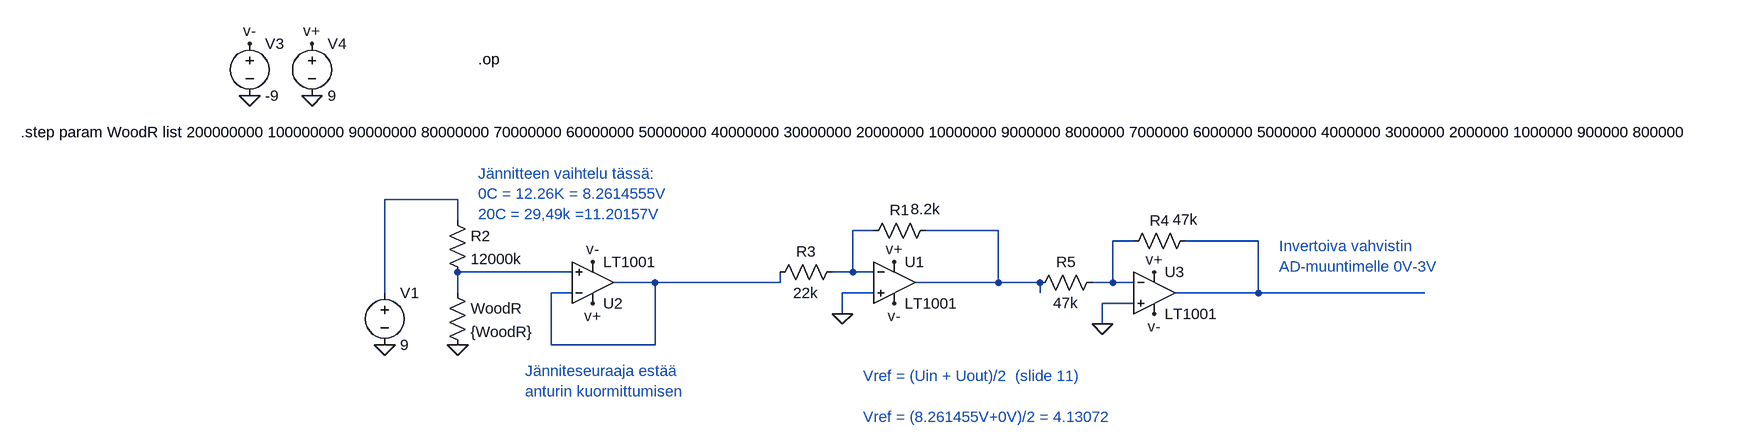
[diagram p0: schematic Wood_moisture.asc]
Wood_moisture.asc, the LTspice schematic file:
Version 4
SHEET 1 2772 696
WIRE 176 352 64 352
WIRE 176 384 176 352
WIRE 816 400 784 400
WIRE 1008 400 896 400
WIRE 1216 416 1184 416
WIRE 1408 416 1296 416
WIRE 352 464 176 464
WIRE 784 464 784 400
WIRE 784 464 752 464
WIRE 816 464 784 464
WIRE 480 480 416 480
WIRE 672 480 672 464
WIRE 672 480 480 480
WIRE 1008 480 1008 400
WIRE 1008 480 880 480
WIRE 1072 480 1008 480
WIRE 1184 480 1184 416
WIRE 1184 480 1152 480
WIRE 1216 480 1184 480
WIRE 64 496 64 352
WIRE 176 496 176 464
WIRE 352 496 320 496
WIRE 816 496 768 496
WIRE 1072 496 1072 480
WIRE 1408 496 1408 416
WIRE 1408 496 1280 496
WIRE 1664 496 1408 496
WIRE 1216 512 1168 512
WIRE 768 528 768 496
WIRE 1168 544 1168 512
WIRE 320 576 320 496
WIRE 480 576 480 480
WIRE 480 576 320 576
FLAG 176 576 0
FLAG 64 576 0
FLAG 768 528 0
FLAG -144 192 0
FLAG -48 192 0
FLAG -48 112 v+
FLAG 848 448 v+
FLAG -144 112 v-
FLAG 848 512 v-
FLAG 384 512 v+
FLAG 384 448 v-
FLAG 1248 464 v+
FLAG 1248 528 v-
FLAG 1168 544 0
SYMBOL res 160 480 R0
SYMATTR InstName WoodR
SYMATTR Value {WoodR}
SYMBOL res 160 368 R0
SYMATTR InstName R2
SYMATTR Value 12000k
SYMBOL voltage 64 480 R0
WINDOW 123 0 0 Left 2
WINDOW 39 0 0 Left 2
SYMATTR InstName V1
SYMATTR Value 9
SYMBOL Opamps\\LT1001 848 416 R0
SYMATTR InstName U1
SYMBOL res 800 416 R270
WINDOW 0 32 56 VTop 2
WINDOW 3 65 96 VBottom 2
SYMATTR InstName R1
SYMATTR Value 8.2k
SYMBOL res 656 480 R270
WINDOW 0 32 56 VTop 2
WINDOW 3 0 56 VBottom 2
SYMATTR InstName R3
SYMATTR Value 22k
SYMBOL voltage -144 96 R0
WINDOW 123 0 0 Left 2
WINDOW 39 0 0 Left 2
SYMATTR InstName V3
SYMATTR Value -9
SYMBOL voltage -48 96 R0
WINDOW 123 0 0 Left 2
WINDOW 39 0 0 Left 2
SYMATTR InstName V4
SYMATTR Value 9
SYMBOL Opamps\\LT1001 384 544 M180
SYMATTR InstName U2
SYMBOL Opamps\\LT1001 1248 432 R0
SYMATTR InstName U3
SYMBOL res 1200 432 R270
WINDOW 0 32 56 VTop 2
WINDOW 3 65 96 VBottom 2
SYMATTR InstName R4
SYMATTR Value 47k
SYMBOL res 1056 496 R270
WINDOW 0 32 56 VTop 2
WINDOW 3 0 56 VBottom 2
SYMATTR InstName R5
SYMATTR Value 47k
TEXT -496 248 Left 2 !.step param WoodR list 200000000 100000000 90000000 80000000 70000000 60000000 50000000 40000000 30000000 20000000 10000000 9000000 8000000 7000000 6000000 5000000 4000000 3000000 2000000 1000000 900000 800000
TEXT 208 136 Left 2 !.op
TEXT 208 312 Left 2 ;Jännitteen vaihtelu tässä:\n0C = 12.26K = 8.2614555V\n20C = 29,49k =11.20157V
TEXT 800 624 Left 2 ;Vref = (Uin + Uout)/2  (slide 11)\n \nVref = (8.261455V+0V)/2 = 4.13072
TEXT 280 616 Left 2 ;Jänniteseuraaja estää\nanturin kuormittumisen
TEXT 1440 424 Left 2 ;Invertoiva vahvistin\nAD-muuntimelle 0V-3V

The netlist it stands for:
* Wood_moisture.asc
R§WoodR N006 0 {WoodR}
R2 N001 N006 12000k
V1 N001 0 9
XU1 0 N002 v+ v- N003 LT1001  ; pins In+ In- V+ V- OUT
R1 N002 N003 8.2k
R3 N007 N002 22k
V3 v- 0 -9
V4 v+ 0 9
XU2 N006 N007 v+ v- N007 LT1001  ; pins In+ In- V+ V- OUT
XU3 0 N004 v+ v- N005 LT1001  ; pins In+ In- V+ V- OUT
R4 N004 N005 47k
R5 N003 N004 47k
.step param WoodR list 200000000 100000000 90000000 80000000 70000000 60000000 50000000 40000000 30000000 20000000 10000000 9000000 8000000 7000000 6000000 5000000 4000000 3000000 2000000 1000000 900000 800000
.op
* Jännitteen vaihtelu tässä:
* 0C = 12.26K = 8.2614555V
* 20C = 29,49k =11.20157V
* Vref = (Uin + Uout)/2  (slide 11)
* Vref = (8.261455V+0V)/2 = 4.13072
* Jänniteseuraaja estää
* anturin kuormittumisen
* Invertoiva vahvistin
* AD-muuntimelle 0V-3V
.lib LTC.lib
.backanno
.end